# Altium project mainboard_v1.PrjPcb
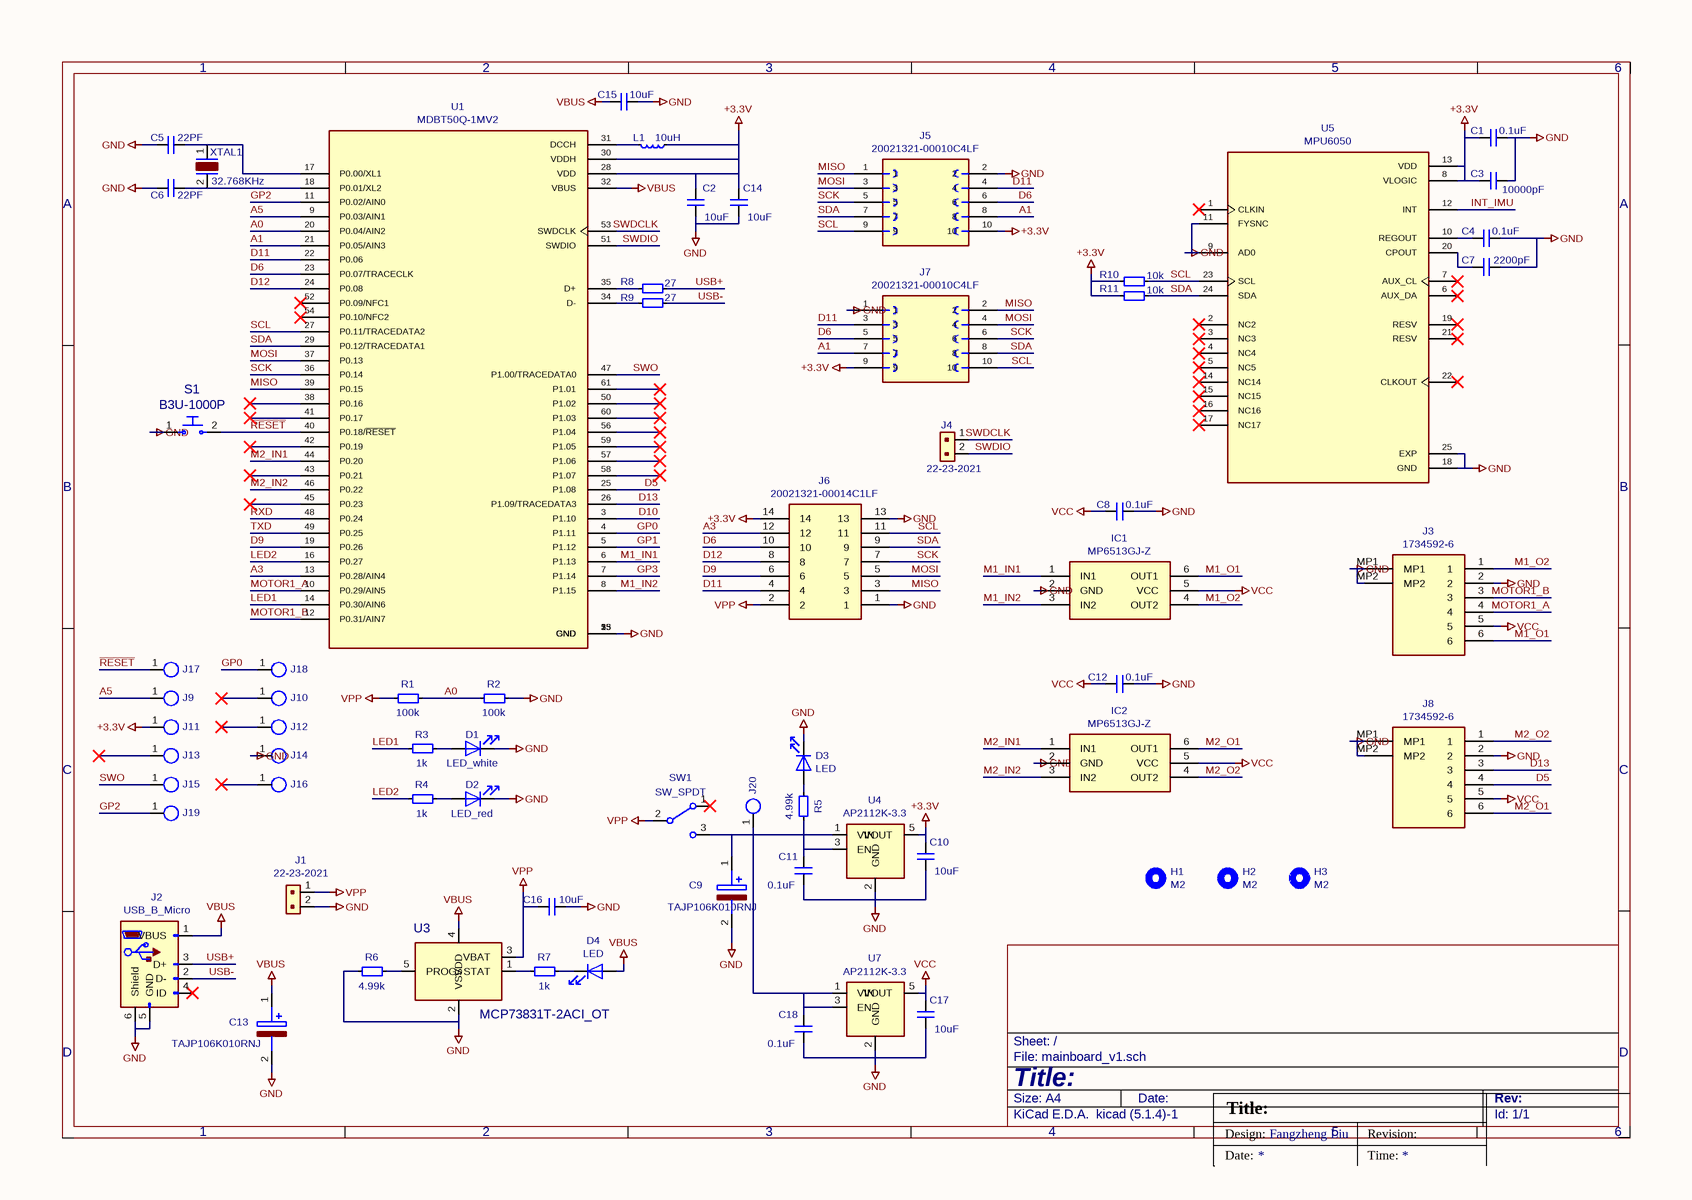
[diagram p0: mainboard_v1.SchDoc]
1 sheet, 67 parts. Net scope: global (net labels, ports and power ports of the same name join across sheets).
Board files: mainboard_v1.PcbDoc, mainboard_v1(1).PcbDoc

## Sheet mainboard_v1.SchDoc
size 297 x 210 mm; Organization: Altium Limited; Address1: L3, 12a Rodborough Rd; Address2: Frenchs Forest; Address3: NSW; Address4: Australia 2086

### Parts
C1  0.1uF  [C_0603_1608Metric_Pad1.08x0.95mm_HandSolder]
C2  10uF  [C_0603_1608Metric_Pad1.08x0.95mm_HandSolder]
C3  10000pF  [C_0603_1608Metric_Pad1.08x0.95mm_HandSolder]
C4  0.1uF  [C_0603_1608Metric_Pad1.08x0.95mm_HandSolder]
C5  22PF  [C_0603_1608Metric_Pad1.08x0.95mm_HandSolder]
C6  22PF  [C_0603_1608Metric_Pad1.08x0.95mm_HandSolder]
C7  2200pF  [C_0603_1608Metric_Pad1.08x0.95mm_HandSolder]
C8  0.1uF  [C_0603_1608Metric_Pad1.08x0.95mm_HandSolder]
C9  TAJP106K010RNJ  [CAPPM2014X170N]
C10  10uF  [C_0603_1608Metric_Pad1.08x0.95mm_HandSolder]
C11  0.1uF  [C_0603_1608Metric_Pad1.08x0.95mm_HandSolder]
C12  0.1uF  [C_0603_1608Metric_Pad1.08x0.95mm_HandSolder]
C13  TAJP106K010RNJ  [CAPPM2014X170N]
C14  10uF  [C_0603_1608Metric_Pad1.08x0.95mm_HandSolder]
C15  10uF  [C_0603_1608Metric_Pad1.08x0.95mm_HandSolder]
C16  10uF  [C_0603_1608Metric_Pad1.08x0.95mm_HandSolder]
C17  10uF  [C_0603_1608Metric_Pad1.08x0.95mm_HandSolder]
C18  0.1uF  [C_0603_1608Metric_Pad1.08x0.95mm_HandSolder]
D1  LED_white  [LED_0603_1608Metric_Pad1.05x0.95mm_HandSolder]
D2  LED_red  [LED_0603_1608Metric_Pad1.05x0.95mm_HandSolder]
D3  LED  [LED_0603_1608Metric_Pad1.05x0.95mm_HandSolder]
D4  LED  [LED_0603_1608Metric_Pad1.05x0.95mm_HandSolder]
H1  M2  [mounthole_1.8mm]
H2  M2  [mounthole_1.8mm]
H3  M2  [mounthole_1.8mm]
IC1  MP6513GJ-Z  [SOT95P280X100-6N]
IC2  MP6513GJ-Z  [SOT95P280X100-6N]
J1  22-23-2021  [PinHeader_1x02_P1.27mm_Vertical]
J2  USB_B_Micro  [USB_Micro-B_Amphenol_10104110_Horizontal]
J3  1734592-6  [17345926]
J4  22-23-2021  [PinHeader_2x01_P1.27mm_Vertical]
J5  20021321-00010C4LF  [HARWIN_M50-3100545]
J6  20021321-00014C1LF  [2002132100014C1LF]
J7  20021321-00010C4LF  [HARWIN_M50-3100545]
J8  1734592-6  [17345926]
J9  1_pin_sig  [1.27mm_pin_hole]  (value not drawn)
J10  1_pin_sig  [1.27mm_pin_hole]  (value not drawn)
J11  1_pin_sig  [1.27mm_pin_hole]  (value not drawn)
J12  1_pin_sig  [1.27mm_pin_hole]  (value not drawn)
J13  1_pin_sig  [1.27mm_pin_hole]  (value not drawn)
J14  1_pin_sig  [1.27mm_pin_hole]  (value not drawn)
J15  1_pin_sig  [1.27mm_pin_hole]  (value not drawn)
J16  1_pin_sig  [1.27mm_pin_hole]  (value not drawn)
J17  1_pin_sig  [1.27mm_pin_hole]  (value not drawn)
J18  1_pin_sig  [1.27mm_pin_hole]  (value not drawn)
J19  1_pin_sig  [1.27mm_pin_hole]  (value not drawn)
J20  1_pin_sig  [1.27mm_pin_hole]  (value not drawn)
L1  10uH  [L_0603_1608Metric_Pad1.05x0.95mm_HandSolder]
R1  100k  [R_0603_1608Metric_Pad0.98x0.95mm_HandSolder]
R2  100k  [R_0603_1608Metric_Pad0.98x0.95mm_HandSolder]
R3  1k  [R_0603_1608Metric_Pad0.98x0.95mm_HandSolder]
R4  1k  [R_0603_1608Metric_Pad0.98x0.95mm_HandSolder]
R5  4.99k  [R_0603_1608Metric_Pad0.98x0.95mm_HandSolder]
R6  4.99k  [R_0603_1608Metric_Pad0.98x0.95mm_HandSolder]
R7  1k  [R_0603_1608Metric_Pad0.98x0.95mm_HandSolder]
R8  27  [R_0603_1608Metric_Pad0.98x0.95mm_HandSolder]
R9  27  [R_0603_1608Metric_Pad0.98x0.95mm_HandSolder]
R10  10k  [R_0603_1608Metric_Pad0.98x0.95mm_HandSolder]
R11  10k  [R_0603_1608Metric_Pad0.98x0.95mm_HandSolder]
S1  B3U-1000P  [Switch_Tactile_SMD_B3U-1000P]
SW1  SW_SPDT  [SW_SPDT_PCM12]
U1  MDBT50Q-1MV2  [XCVR_MDBT50Q-1MV2]
U3  MCP73831T-2ACI_OT  [SOT-23-5_HandSoldering]
U4  AP2112K-3.3  [SOT-23-5_HandSoldering]
U5  MPU6050  [IC_MPU6050]
U7  AP2112K-3.3  [SOT-23-5_HandSoldering]
XTAL1  32.768KHz  [ECS32712512TR]

### Nets
+3.3V: C1.2 C2.2 C3.2 C10.2 C14.2 J5.10 J6.14 J7.9 J11.1 L1.1 R10.2 R11.2 U1.28(VDD) U1.30(VDDH) U4.5(VOUT) U5.8(VLOGIC) U5.13(VDD)
GND: C1.1 C2.1 C3.1 C4.1 C5.2 C6.2 C7.1 C8.1 C9.2 C10.1 C11.1 C12.1 C13.2 C14.1 C15.1 C16.1 C17.1 C18.1 D1.1(K) D2.1(K) D3.1(K) IC1.2(GND) IC2.2(GND) J1.2 J2.5(GND) J2.6(Shield) J3.2 J3.MP1 J3.MP2 J5.2 J6.1 J6.13 J7.1 J8.2 J8.MP1 J8.MP2 J14.1 R2.1 R6.2 S1.1 U1.1(GND) U1.2(GND) U1.15(GND) U1.33(GND) U1.55(GND) U3.2(VSS) U4.2(GND) U5.9(AD0) U5.11(FYSNC) U5.18(GND) U5.25(EXP) U7.2(GND)
VBUS: C13.1 C15.2 D4.2(A) J2.1(VBUS) U1.32(VBUS) U3.4(VDD)
VCC: C8.2 C12.2 C17.2 IC1.5(VCC) IC2.5(VCC) J3.5 J8.5 U7.5(VOUT)
VPP: C16.2 J1.1 J6.2 R1.2 SW1.2(B) U3.3(VBAT)
A0: R1.1 R2.2 U1.20(P0.04/AIN2)
A1: J5.8 J7.7 U1.21(P0.05/AIN3)
A3: J6.12 U1.13(P0.28/AIN4)
A5: J9.1 U1.9(P0.03/AIN1)
D5: J8.4 U1.25(P1.08)
D6: J5.6 J6.10 J7.5 U1.23(P0.07/TRACECLK)
D9: J6.6 U1.19(P0.26)
D10: U1.3(P1.10)
D11: J5.4 J6.4 J7.3 U1.22(P0.06)
D12: J6.8 U1.24(P0.08)
D13: J8.3 U1.26(P1.09/TRACEDATA3)
GP0: J18.1 U1.4(P1.11)
GP1: U1.5(P1.12)
GP2: J19.1 U1.11(P0.02/AIN0)
GP3: U1.7(P1.14)
INT_IMU: U5.12(INT)
LED1: R3.2 U1.14(P0.30/AIN6)
LED2: R4.2 U1.16(P0.27)
M1_IN1: IC1.1(IN1) U1.6(P1.13)
M1_IN2: IC1.3(IN2) U1.8(P1.15)
M1_O1: IC1.6(OUT1) J3.6
M1_O2: IC1.4(OUT2) J3.1
M2_IN1: IC2.1(IN1) U1.44(P0.20)
M2_IN2: IC2.3(IN2) U1.46(P0.22)
M2_O1: IC2.6(OUT1) J8.6
M2_O2: IC2.4(OUT2) J8.1
MISO: J5.1 J6.3 J7.2 U1.39(P0.15)
MOSI: J5.3 J6.5 J7.4 U1.37(P0.13)
MOTOR1_A: J3.4 U1.10(P0.29/AIN5)
MOTOR1_B: J3.3 U1.12(P0.31/AIN7)
~{RESET}: J17.1 S1.2 U1.40(P0.18/~{RESET})
RXD: U1.48(P0.24)
SCK: J5.5 J6.7 J7.6 U1.36(P0.14)
SCL: J5.9 J6.11 J7.10 R10.1 U1.27(P0.11/TRACEDATA2) U5.23(SCL)
SDA: J5.7 J6.9 J7.8 R11.1 U1.29(P0.12/TRACEDATA1) U5.24(SDA)
SWDCLK: J4.1 U1.53(SWDCLK)
SWDIO: J4.2 U1.51(SWDIO)
SWO: J15.1 U1.47(P1.00/TRACEDATA0)
TXD: U1.49(P0.25)
USB+: J2.3(D+) R8.1
USB-: J2.2(D-) R9.1
NetC4_2: C4.2 U5.10(REGOUT)
NetC5_1: C5.1 U1.17(P0.00/XL1) XTAL1.1
NetC6_1: C6.1 U1.18(P0.01/XL2) XTAL1.2
NetC7_2: C7.2 U5.20(CPOUT)
NetC9_1: C9.1 C11.2 C18.2 J20.1 R5.1 SW1.3(C) U4.1(VIN) U4.3(EN) U7.1(VIN) U7.3(EN)
NetD1_2: D1.2(A) R3.1
NetD2_2: D2.2(A) R4.1
NetD3_2: D3.2(A) R5.2
NetD4_1: D4.1(K) R7.1
NetL1_2: L1.2 U1.31(DCCH)
NetR6_1: R6.1 U3.5(PROG)
NetR7_2: R7.2 U3.1(STAT)
NetR8_2: R8.2 U1.35(D+)
NetR9_2: R9.2 U1.34(D-)

Not connected (* = marked no-connect by the designer): J2 4(ID)*; J10 1*; J12 1*; J13 1*; J16 1*; SW1 1(A)*; U1 38(P0.16)* 41(P0.17)* 42(P0.19)* 43(P0.21)* 45(P0.23)* 50(P1.02)* 52(P0.09/NFC1)* 54(P0.10/NFC2)* 56(P1.04)* 57(P1.06)* 58(P1.07)* 59(P1.05)* 60(P1.03)* 61(P1.01)*; U4 4(NC); U5 1(CLKIN)* 2(NC2)* 3(NC3)* 4(NC4)* 5(NC5)* 6(AUX_DA)* 7(AUX_CL)* 14(NC14)* 15(NC15)* 16(NC16)* 17(NC17)* 19(RESV)* 21(RESV)* 22(CLKOUT)*; U7 4(NC)

### Notes on the sheet
- 1
- 2
- 3
- 4
- 5
- 6
- A
- B
- C
- D
- Title:
- File: mainboard_v1.sch
- Sheet: /
- KiCad E.D.A.  kicad (5.1.4)-1
- Size: A4
- Date:
- Design:
- Fangzheng Liu
- Revision:
- Rev:
- Id: 1/1
- Time:

### Library data of the parts
C1-C8 C10-C12 C14-C18 = C_Small: Footprint: Capacitor_SMD:C_0603_1608Metric_Pad1.08x0.95mm_HandSolder
  C1 C4 C8 C11 C12 C18: Value: 0.1uF
  C2 C10 C14-C17: Value: 10uF
  C3: Value: 10000pF
  C5 C6: Value: 22PF
  C7: Value: 2200pF
C9 C13 = TAJP106K010RNJ: Manufacturer_Name: AVX; Description: Tantalum Capacitors - Solid SMD 10V 10uF 10%; Height: 1.7; Manufacturer_Part_Number: TAJP106K010RNJ; Mouser Part Number: 581-TAJP106K010RNJ; Mouser Price/Stock: https://www.mouser.co.uk/ProductDetail/AVX/TAJP106K010RNJ?qs=vQJa%252BfcOt8MTne6Zr4ogJg%3D%3D; Arrow Part Number: TAJP106K010RNJ; Arrow Price/Stock: https://www.arrow.com/en/products/tajp106k010rnj/avx?region=nac; Value: TAJP106K010RNJ; Footprint: SamacSys_Parts:CAPPM2014X170N
D1 D2 = LED: Footprint: LED_SMD:LED_0603_1608Metric_Pad1.05x0.95mm_HandSolder
  D1: Value: LED_white
  D2: Value: LED_red
H1-H3 = MountingHole: Value: M2; Footprint: Mylib:mounthole_1.8mm
IC1 IC2 = MP6513GJ-Z: Manufacturer_Name: Monolithic Power Systems (MPS); Description: Power Switch ICs - Power Distribution 2.5V-21V 0.8A Half Bridge Motor Driver; Height: 1; Manufacturer_Part_Number: MP6513GJ-Z; Mouser Part Number: 946-MP6513GJ-Z; Mouser Price/Stock: https://www.mouser.co.uk/ProductDetail/Monolithic-Power-Systems-MPS/MP6513GJ-Z?qs=FfNbArp%252BdljFzTtslD%252B1UQ%3D%3D; Value: MP6513GJ-Z; Footprint: SamacSys_Parts:SOT95P280X100-6N
J1 J4 = 22-23-2021: Manufacturer: Molex; DK_Detail_Page: /product-detail/en/molex/22-23-2021/WM4200-ND/26667; Description: CONN HEADER VERT 2POS 2.54MM; Digi-Key_PN: WM4200-ND; MPN: 22-23-2021; Category: Connectors, Interconnects; Family: Rectangular Connectors - Headers, Male Pins; DK_Datasheet_Link: https://media.digikey.com/pdf/Data%20Sheets/Molex%20PDFs/A-6373-N_Series_Dwg_2010-12-03.pdf; Status: Active; Value: 22-23-2021
  J1: Footprint: Connector_PinHeader_1.27mm:PinHeader_1x02_P1.27mm_Vertical
  J4: Footprint: Connector_PinHeader_1.27mm:PinHeader_2x01_P1.27mm_Vertical
J3 J8 = 1734592-6: Manufacturer_Name: TE Connectivity; Description: FFC & FPC Connectors FPC CONN. 0.5MM PITCH B/C 6P; Height: 2; Manufacturer_Part_Number: 1734592-6; Mouser Part Number: 571-1734592-6; Mouser Price/Stock: https://www.mouser.co.uk/ProductDetail/TE-Connectivity/1734592-6?qs=n3Ybsy482HHDh9IzLv%252BLHw%3D%3D; Arrow Part Number: 1734592-6; Arrow Price/Stock: https://www.arrow.com/en/products/1734592-6/te-connectivity?region=nac; Value: 1734592-6; Footprint: SamacSys_Parts:17345926
J5 J7 = M50-3100545: MANUFACTURER: Harwin Inc.; PARTREV: 08.01.13; STANDARD: Manufacturer Recommendations; MAXIMUM_PACKAGE_HEIGHT: 4.85 mm; Value: 20021321-00010C4LF; Footprint: SnapEDA Library:HARWIN_M50-3100545
J6 = 20021321-00014C1LF: Manufacturer_Name: Amphenol; Description: Headers & Wire Housings 20021321-00014C1LF-RECEPTACLE VT SMT; Height: 4.75; Manufacturer_Part_Number: 20021321-00014C1LF; Mouser Part Number: 649-20213210014C1LF; Mouser Price/Stock: https://www.mouser.co.uk/ProductDetail/Amphenol-FCI/20021321-00014C1LF?qs=fmpTyLOWOeyzBByVTT8pPA%3D%3D; Arrow Part Number: 20021321-00014C1LF; Arrow Price/Stock: https://www.arrow.com/en/products/20021321-00014c1lf/amphenol-fci?region=nac; Value: 20021321-00014C1LF; Footprint: SamacSys_Parts:2002132100014C1LF
L1 = L_Small: Value: 10uH; Footprint: Inductor_SMD:L_0603_1608Metric_Pad1.05x0.95mm_HandSolder
R1-R11 = R_Small: Footprint: Resistor_SMD:R_0603_1608Metric_Pad0.98x0.95mm_HandSolder
  R1 R2: Value: 100k
  R3 R4 R7: Value: 1k
  R5 R6: Value: 4.99k
  R8 R9: Value: 27
  R10 R11: Value: 10k
S1 = B3U-1000P: Manufacturer: Omron Electronics Inc-EMC Div; DK_Detail_Page: /product-detail/en/omron-electronics-inc-emc-div/B3U-1000P/SW1020CT-ND/1534357; Description: SWITCH TACTILE SPST-NO 0.05A 12V; Digi-Key_PN: SW1020CT-ND; MPN: B3U-1000P; Category: Switches; Family: Tactile Switches; DK_Datasheet_Link: https://omronfs.omron.com/en_US/ecb/products/pdf/en-b3u.pdf; Status: Active; Value: B3U-1000P; Footprint: digikey-footprints:Switch_Tactile_SMD_B3U-1000P
U1 = MDBT50Q-1MV2: MANUFACTURER: RAYTAC; MAXIMUM_PACKAGE_HIEGHT: 2.05mm; PARTREV: H; STANDARD: Manufacturer Recommendations; Value: MDBT50Q-1MV2; Footprint: Mylib:XCVR_MDBT50Q-1MV2
U3 = MCP73831T-2ACI_OT: MPN: MCP73831T-2ACI/OT; Manufacturer: Microchip Technology; DK_Detail_Page: /product-detail/en/microchip-technology/MCP73831T-2ACI-OT/MCP73831T-2ACI-OTCT-ND/1979802; Description: IC CONTROLLR LI-ION 4.2V SOT23-5; Digi-Key_PN: MCP73831T-2ACI/OTCT-ND; Category: Integrated Circuits (ICs); Family: PMIC - Battery Chargers; DK_Datasheet_Link: http://ww1.microchip.com/downloads/en/DeviceDoc/20001984g.pdf; Status: Active; Value: MCP73831T-2ACI_OT; Footprint: Package_TO_SOT_SMD:SOT-23-5_HandSoldering
U5 = MPU6050: MANUFACTURER: TDK InvenSense; MAXIMUM_PACKAGE_HEIGHT: 0.95 mm; PARTREV: 3.4; STANDARD: Manufacturer Recommendations; Value: MPU6050; Footprint: Mylib:IC_MPU6050
XTAL1 = ECS-_327-12_5-34B-TR: MPN: ECS-.327-12.5-34B-TR; Manufacturer: ECS Inc.; DK_Detail_Page: /product-detail/en/ecs-inc/ECS-.327-12.5-34B-TR/XC1617CT-ND/1693786; Description: CRYSTAL 32.7680KHZ 12.5PF SMD; Digi-Key_PN: XC1617CT-ND; Category: Crystals, Oscillators, Resonators; Family: Crystals; DK_Datasheet_Link: http://www.ecsxtal.com/store/pdf/ecx-31b.pdf; Status: Active; Value: 32.768KHz; Footprint: SamacSys_Parts:ECS32712512TR
D3 D4 = LED: Value: LED; Footprint: LED_SMD:LED_0603_1608Metric_Pad1.05x0.95mm_HandSolder
J2 = USB_B_Micro: Value: USB_B_Micro; Footprint: Connector_USB:USB_Micro-B_Amphenol_10104110_Horizontal
J9-J20 = 1_pin_sig: Value: 1_pin_sig; Footprint: Mylib:1.27mm_pin_hole
SW1 = SW_SPDT: Value: SW_SPDT; Footprint: Button_Switch_SMD:SW_SPDT_PCM12
U4 U7 = AP2112K-3.3: Value: AP2112K-3.3; Footprint: Package_TO_SOT_SMD:SOT-23-5_HandSoldering